# EAGLE schematic v1.1 (EAGLE 6.4)
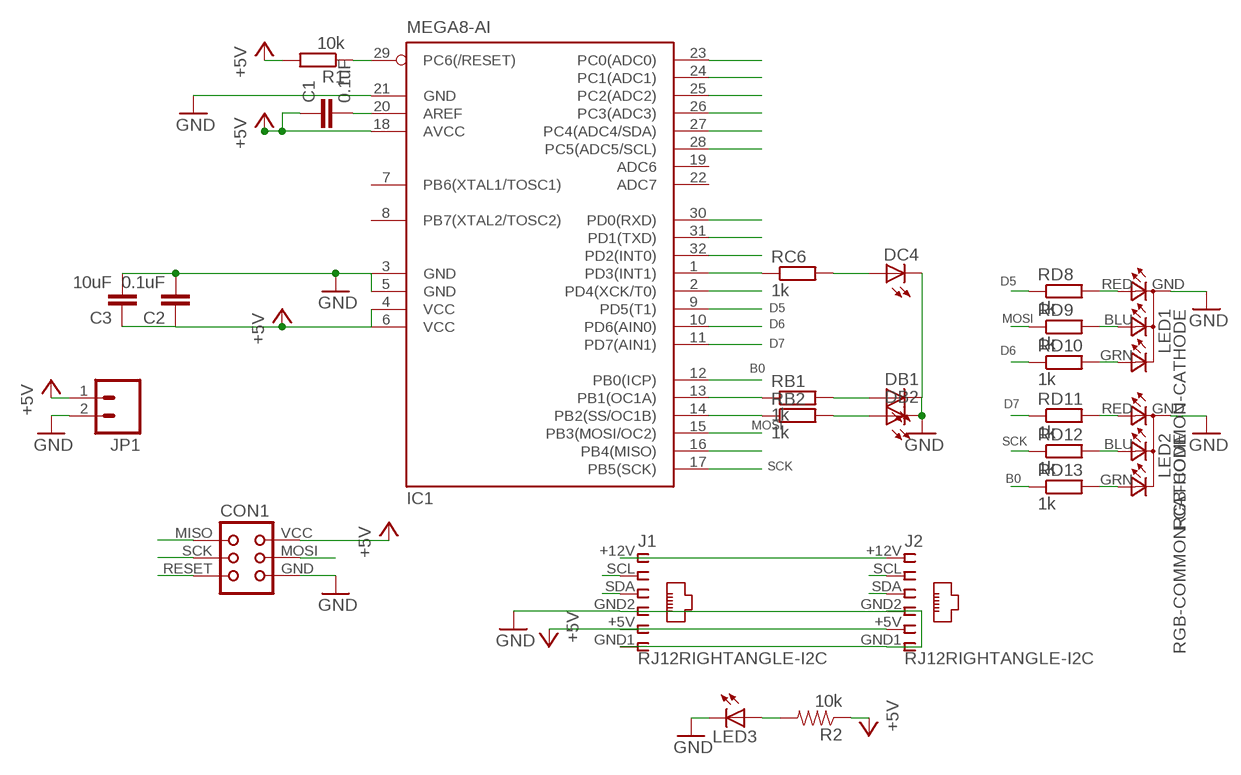
[diagram p0: schematic, sheet 1]

## Parts
C1  0.1uF  C-EUC1206  [C1206]
C2  0.1uF  C-EUC1206  [C1206]
C3  10uF  C-EUC1206  [C1206]
CON1  TINYISP  [TINYISP]
DB1  LED3MM  [LED3MM]
DB2  LED3MM  [LED3MM]
DC4  LED3MM  [LED3MM]
IC1  MEGA8-AI  [TQFP32-08]
J1  RJ12RIGHTANGLE-I2C  [RJ12-RIGHTANGLE-I2C]
J2  RJ12RIGHTANGLE-I2C  [RJ12-RIGHTANGLE-I2C]
JP1  M023.5MM  [SCREWTERMINAL-3.5MM-2]
LED1  RGB-COMMON-CATHODE  [LED-TRICOLOR-THROUGHHOLE]
LED2  RGB-COMMON-CATHODE  [LED-TRICOLOR-THROUGHHOLE]
LED3  LEDCHIP-LED0603  [CHIP-LED0603]
R1  10k  R-EU_M1206  [M1206]
R2  10k  RESISTOR0603-RES  [0603-RES]
RB1  1k  R-EU_M1206  [M1206]
RB2  1k  R-EU_M1206  [M1206]
RC6  1k  R-EU_M1206  [M1206]
RD8  1k  R-EU_M1206  [M1206]
RD9  1k  R-EU_M1206  [M1206]
RD10  1k  R-EU_M1206  [M1206]
RD11  1k  R-EU_M1206  [M1206]
RD12  1k  R-EU_M1206  [M1206]
RD13  1k  R-EU_M1206  [M1206]

## Nets
+5V [power]: C1.1 C2.1 C3.1 CON1.VCC IC1.4(VCC) IC1.6(VCC) IC1.18(AVCC) J1.+5V J2.+5V JP1.1 R1.2 R2.1
B0: IC1.12(PB0(ICP)) RD13.1
D5: IC1.9(PD5(T1)) RD8.1
D6: IC1.10(PD6(AIN0)) RD10.1
D7: IC1.11(PD7(AIN1)) RD11.1
GND [power]: C2.2 C3.2 CON1.GND DB1.K(C) DB2.K(C) DC4.K(C) IC1.3(GND) IC1.5(GND) IC1.21(GND) J1.GND1 J1.GND2 J2.GND1 J2.GND2 JP1.2 LED1.GND(A2) LED2.GND(A2) LED3.C
MISO: CON1.MISO IC1.16(PB4(MISO))
MOSI: CON1.MOSI IC1.15(PB3(MOSI/OC2)) RD9.1
N$1: LED1.RED(CRED) RD8.2
N$2: IC1.24(PC1(ADC1))
N$3: IC1.23(PC0(ADC0))
N$4: C1.2 IC1.20(AREF)
N$5: IC1.26(PC3(ADC3))
N$6: IC1.25(PC2(ADC2))
N$7: LED1.BLU(CBLUE) RD9.2
N$8: LED1.GRN(CGREEN) RD10.2
N$9: IC1.30(PD0(RXD))
N$10: IC1.31(PD1(TXD))
N$11: IC1.1(PD3(INT1)) RC6.1
N$12: IC1.32(PD2(INT0))
N$13: J1.+12V J2.+12V
N$14: IC1.2(PD4(XCK/T0))
N$15: LED3.A R2.2
N$18: IC1.13(PB1(OC1A)) RB1.1
N$19: IC1.14(PB2(SS/OC1B)) RB2.1
N$20: LED2.RED(CRED) RD11.2
N$21: LED2.BLU(CBLUE) RD12.2
N$22: LED2.GRN(CGREEN) RD13.2
N$23: DC4.A RC6.2
N$40: DB1.A RB1.2
N$41: DB2.A RB2.2
RESET: CON1.RESET IC1.29(PC6(/RESET)) R1.1
SCK: CON1.SCK IC1.17(PB5(SCK)) RD12.1
SCL: IC1.28(PC5(ADC5/SCL)) J1.SCL J2.SCL
SDA: IC1.27(PC4(ADC4/SDA)) J1.SDA J2.SDA
Unconnected: IC1.7(PB6(XTAL1/TOSC1)) IC1.8(PB7(XTAL2/TOSC2)) IC1.19(ADC6) IC1.22(ADC7)

## Library data of the parts
C1-C3 = resistor:C-EU: CAPACITOR, European symbol
CON1 = lpatiny:TINYISP: CONNECTOR; OC_FARNELL: unknown; OC_NEWARK: unknown
DB1 DB2 DC4 = led:LED: LED
IC1 = atmel:MEGA8: MICROCONTROLLER 8 Kbytes FLASH, 1 kbytes SRAM, 512 bytes EEPROM, USART, 6-channel 10 bit ADC, 2-channel 8 bit ADC Pin compatible with Atmega48, ATMega88, ATMega168 Source: avr.lbr; MPN: ATMEGA8-16AU; OC_FARNELL: 9171371; OC_NEWARK: 73M8863
J1 J2 = lpatiny:RJ12: CORCOM Modular RJ Jacks No Shield Source: www.tycoelectronics.com .. ENG_DS_1654001_1099_RJ_L_0507.pdf
JP1 = SparkFun:M02: Header 2 Standard 2-pin 0.1" header. Use with straight break away headers (SKU : PRT-00116), right angle break away headers (PRT-00553), swiss pins (PRT-00743), machine pins (PRT-00117), and female headers (PRT-00115). Molex polarized connector foot print use with SKU : PRT-08233 with associated crimp pins and housings.
LED1 LED2 = lpatiny:RGB-COMMON-CATHODE
LED3 = adafruit:LED: LED
R1 RB1 RB2 RC6 RD8-RD13 = resistor:R-EU_: RESISTOR, European symbol
R2 = SparkFun:RESISTOR: Resistor Basic schematic elements and footprints for 0603, 1206, and PTH resistors.

## Net classes
1 power: width 0.406 mm